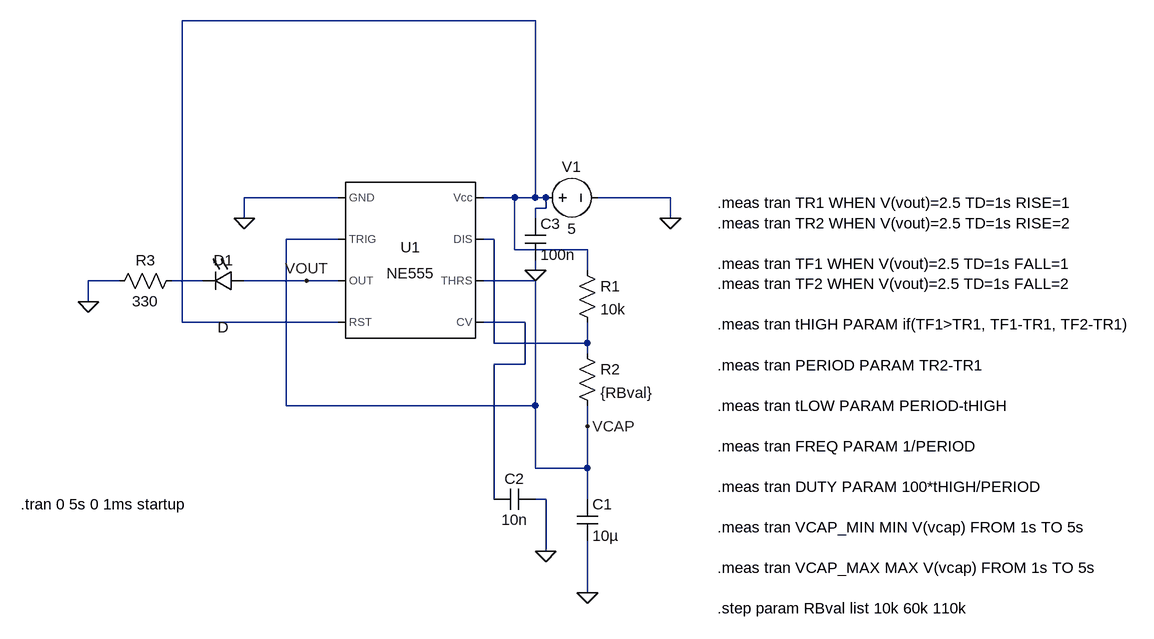
[diagram p0: schematic pcb001_ne555_astable.asc]
pcb001_ne555_astable.asc, the LTspice schematic file:
Version 4.1
SHEET 1 1800 708
WIRE 400 -192 -144 -192
WIRE 96 80 -48 80
WIRE 368 80 320 80
WIRE 400 80 400 -192
WIRE 400 80 368 80
WIRE 416 80 400 80
WIRE 608 80 496 80
WIRE 416 96 416 80
WIRE 416 96 400 96
WIRE -48 112 -48 80
WIRE 400 112 400 96
WIRE 608 112 608 80
WIRE 96 144 16 144
WIRE 336 144 320 144
WIRE 368 160 368 80
WIRE 480 160 368 160
WIRE 400 192 400 176
WIRE 480 192 480 160
WIRE -240 208 -288 208
WIRE -112 208 -160 208
WIRE 48 208 -48 208
WIRE 96 208 48 208
WIRE 400 208 320 208
WIRE -288 240 -288 208
WIRE -144 272 -144 -192
WIRE 96 272 -144 272
WIRE 384 272 320 272
WIRE 336 304 336 144
WIRE 480 304 480 272
WIRE 480 304 336 304
WIRE 480 320 480 304
WIRE 384 336 384 272
WIRE 384 336 336 336
WIRE 16 400 16 144
WIRE 400 400 400 208
WIRE 400 400 16 400
WIRE 480 432 480 400
WIRE 400 496 400 400
WIRE 480 496 480 432
WIRE 480 496 400 496
WIRE 336 544 336 336
WIRE 416 544 400 544
WIRE 480 544 480 496
WIRE 416 624 416 544
WIRE 480 688 480 608
FLAG 608 112 0
FLAG -48 112 0
FLAG 480 688 0
FLAG 416 624 0
FLAG -288 240 0
FLAG 400 192 0
FLAG 480 432 VCAP
FLAG 48 208 VOUT
SYMBOL Misc\\NE555 208 176 R0
SYMATTR InstName U1
SYMBOL voltage 400 80 R270
WINDOW 0 32 56 VTop 2
WINDOW 3 -32 56 VBottom 2
WINDOW 123 0 0 Left 0
WINDOW 39 0 0 Left 0
SYMATTR InstName V1
SYMATTR Value 5
SYMBOL res 464 176 R0
SYMATTR InstName R1
SYMATTR Value 10k
SYMBOL res 464 304 R0
SYMATTR InstName R2
SYMATTR Value {RBval}
SYMBOL cap 464 544 R0
SYMATTR InstName C1
SYMATTR Value 10µ
SYMBOL cap 400 528 R90
WINDOW 0 0 32 VBottom 2
WINDOW 3 32 32 VTop 2
SYMATTR InstName C2
SYMATTR Value 10n
SYMBOL LED -48 192 R90
WINDOW 0 0 32 VBottom 2
WINDOW 3 72 32 VTop 2
SYMATTR InstName D1
SYMBOL res -144 192 R90
WINDOW 0 0 56 VBottom 2
WINDOW 3 32 56 VTop 2
SYMATTR InstName R3
SYMATTR Value 330
SYMBOL cap 384 112 R0
SYMATTR InstName C3
SYMATTR Value 100n
TEXT -392 552 Left 2 !.tran 0 5s 0 1ms startup
TEXT 680 88 Left 2 !.meas tran TR1 WHEN V(vout)=2.5 TD=1s RISE=1\n.meas tran TR2 WHEN V(vout)=2.5 TD=1s RISE=2\n \n.meas tran TF1 WHEN V(vout)=2.5 TD=1s FALL=1\n.meas tran TF2 WHEN V(vout)=2.5 TD=1s FALL=2\n \n.meas tran tHIGH PARAM if(TF1>TR1, TF1-TR1, TF2-TR1)\n \n.meas tran PERIOD PARAM TR2-TR1\n \n.meas tran tLOW PARAM PERIOD-tHIGH\n \n.meas tran FREQ PARAM 1/PERIOD\n \n.meas tran DUTY PARAM 100*tHIGH/PERIOD\n \n.meas tran VCAP_MIN MIN V(vcap) FROM 1s TO 5s\n \n.meas tran VCAP_MAX MAX V(vcap) FROM 1s TO 5s\n \n.step param RBval list 10k 60k 110k

The netlist it stands for:
* pcb001_ne555_astable.asc
X§U1 0 VCAP VOUT N001 N004 VCAP N002 N001 NE555  ; pins GND TRIG OUT RST CV THRS DIS Vcc
V1 N001 0 5
R1 N001 N002 10k
R2 N002 VCAP {RBval}
C1 VCAP 0 10µ
C2 0 N004 10n
D1 VOUT N003 D
R3 N003 0 330
C3 N001 0 100n
.model D D
.lib standard.dio
.tran 0 5s 0 1ms startup
.meas tran TR1 WHEN V(vout)=2.5 TD=1s RISE=1
.meas tran TR2 WHEN V(vout)=2.5 TD=1s RISE=2
.meas tran TF1 WHEN V(vout)=2.5 TD=1s FALL=1
.meas tran TF2 WHEN V(vout)=2.5 TD=1s FALL=2
.meas tran tHIGH PARAM if(TF1>TR1, TF1-TR1, TF2-TR1)
.meas tran PERIOD PARAM TR2-TR1
.meas tran tLOW PARAM PERIOD-tHIGH
.meas tran FREQ PARAM 1/PERIOD
.meas tran DUTY PARAM 100*tHIGH/PERIOD
.meas tran VCAP_MIN MIN V(vcap) FROM 1s TO 5s
.meas tran VCAP_MAX MAX V(vcap) FROM 1s TO 5s
.step param RBval list 10k 60k 110k
.lib NE555.sub
.backanno
.end